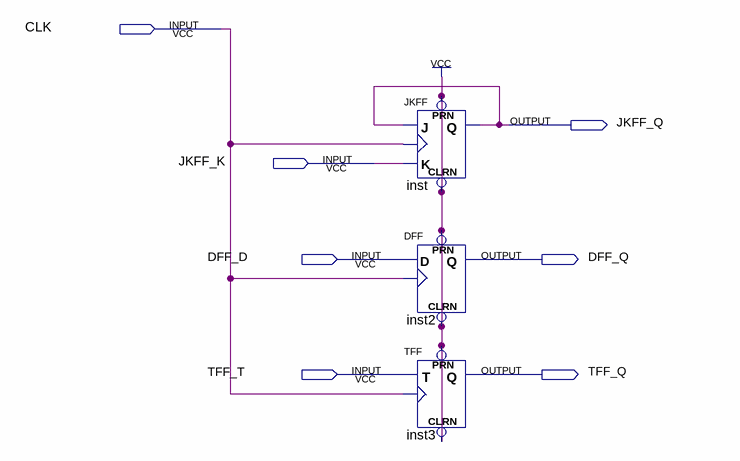
[diagram p0: schematic sheet]
// Quartus schematic test_ff.bdf as structural Verilog: 3 symbols, 7 pins
module test_ff (
  input  CLK,
  input  JKFF_K,
  input  DFF_D,
  input  TFF_T,
  output JKFF_Q,
  output DFF_Q,
  output TFF_Q
);

  JKFF inst (.PRN(1'b1), .CLRN(1'b1), .K(JKFF_K), .J(JKFF_Q), .CLK(CLK), .Q(JKFF_Q));
  DFF inst2 (.CLRN(1'b1), .CLK(CLK), .D(DFF_D), .PRN(1'b1), .Q(DFF_Q));
  TFF inst3 (.PRN(1'b1), .CLRN(1'b1), .T(TFF_T), .CLK(CLK), .Q(TFF_Q));
endmodule
